# Altium schematic sheet 7_COMMUNICATION.schdoc
size 307 x 218 mm; Symbol: A4空白; Device: A4空白; @Project Name: 34567890; @Page Count: 7; @Update Date: 2025-05-12; @Create Date: 2025-03-11; @Schematic Name: Schematic1; @Page No: 7; @Page Name: COMMUNICATION; @Create Time: 07:05:34; @Board Name: PCB; @Update Time: 12:27:56; Title Block Position: 3; Width: 1170; Height: 825; Region Start: 1; X Region Count: 6; Y Region Count: 4; Blade Width: 10; SheetNumber: 7; SheetTotal: 7
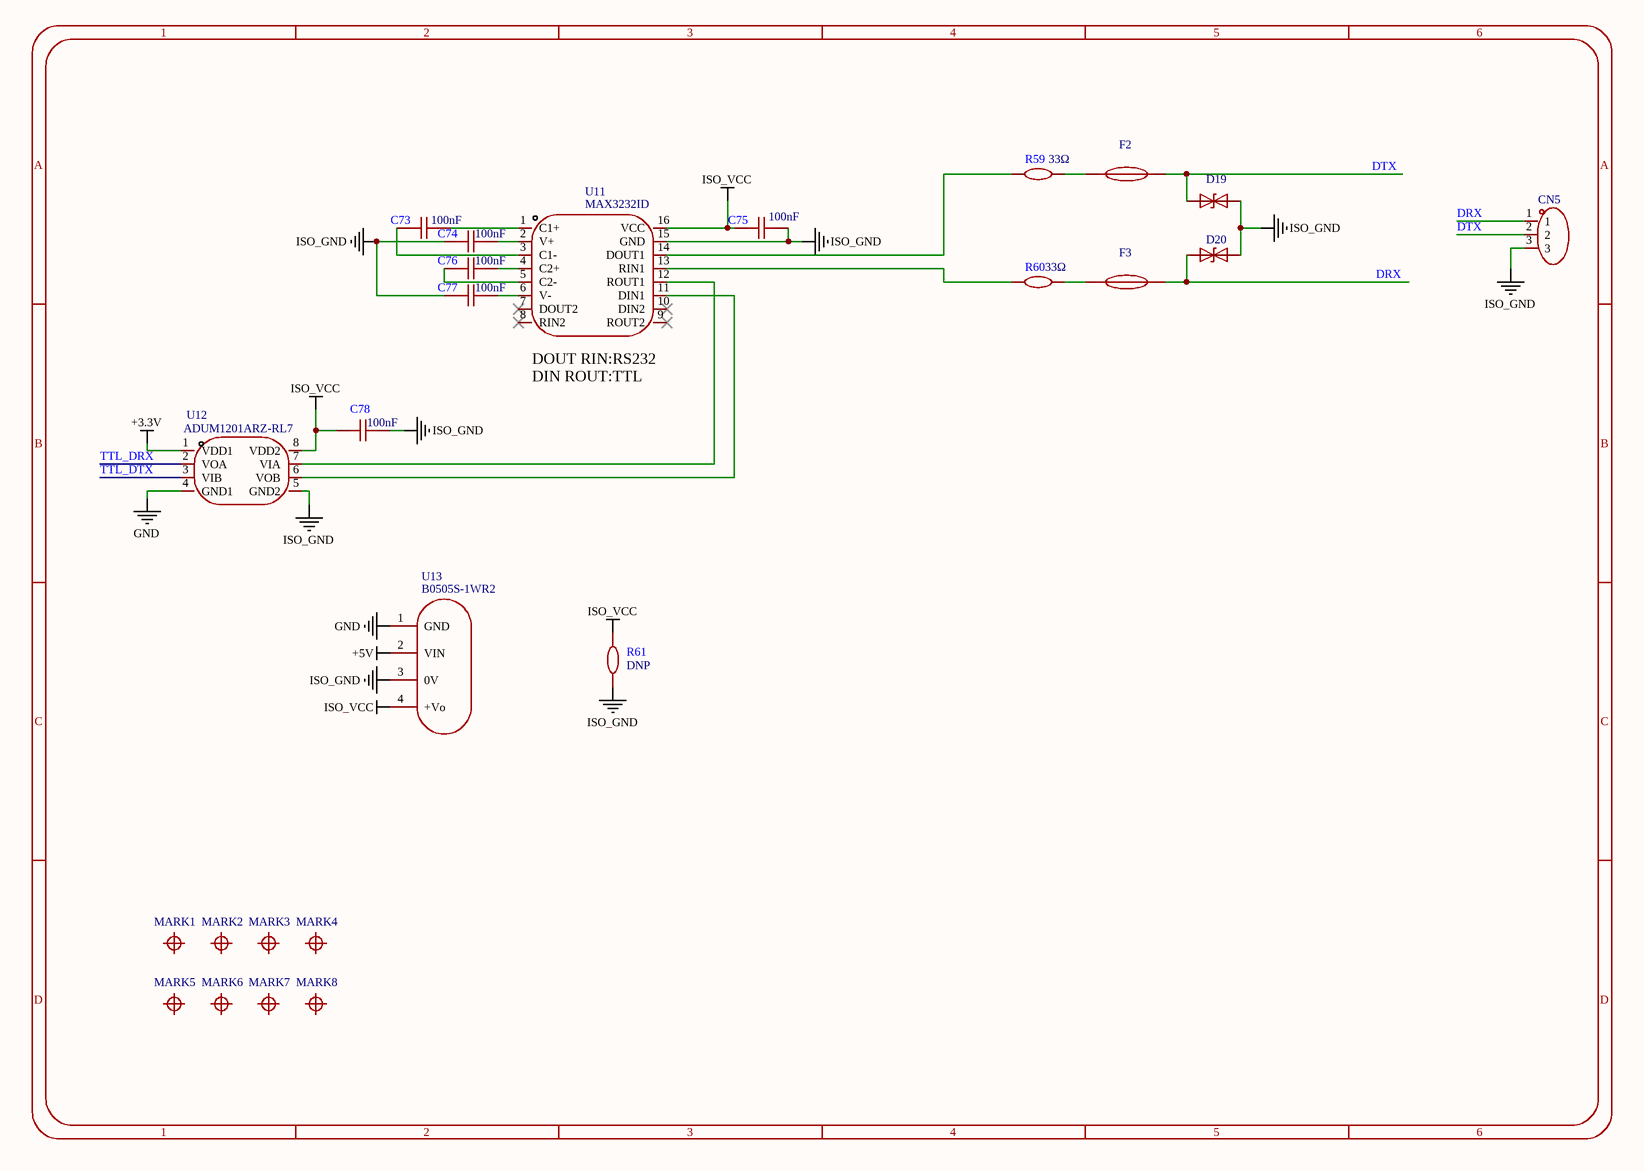
[diagram p0: 7_COMMUNICATION.schdoc]

## Parts
C73  100nF  [C0603]
C74  100nF  [C0603]
C75  100nF  [C0603]
C76  100nF  [C0603]
C77  100nF  [C0603]
C78  100nF  [C0603]
CN5  WJ15EDGRC-3.81-3P  [CONN-TH_3P-P3.81_WJ15EDGRC-3.81-3P]  (value not drawn)
D19  SMAJ15CA-E3/61  [SMA_L4.3-W2.7-LS5.1-BI]  (value not drawn)
D20  SMAJ15CA-E3/61  [SMA_L4.3-W2.7-LS5.1-BI]  (value not drawn)
F2  JK-NSMD050-30V  [F1206]  (value not drawn)
F3  JK-NSMD050-30V  [F1206]  (value not drawn)
MARK1  (no value)  [Mark-Point-1mm]
MARK2  (no value)  [Mark-Point-1mm]
MARK3  (no value)  [Mark-Point-1mm]
MARK4  (no value)  [Mark-Point-1mm]
MARK5  (no value)  [Mark-Point-1mm]
MARK6  (no value)  [Mark-Point-1mm]
MARK7  (no value)  [Mark-Point-1mm]
MARK8  (no value)  [Mark-Point-1mm]
R59  33Ω  [R0603]
R60  33Ω  [R0603]
R61  DNP  [R0603]
U11  MAX3232ID  [SOIC-16_L9.9-W3.9-P1.27-LS6.0-BL]
U12  ADUM1201ARZ-RL7  [SOIC-8_L4.9-W3.9-P1.27-LS6.0-BL]
U13  B0505S-1WR2  [PWRM-TH_BXXXXS-1WR2]

## Nets
+3.3V: U12.1(VDD1)
+5V: U13.2(VIN)
GND: U12.4(GND1) U13.1(GND)
ISO_GND: C74.2 C75.1 C77.2 C78.1 CN5.3 D19.2(A) D20.1(K) R61.1 U11.15(GND) U12.5(GND2) U13.3(0V)
ISO_VCC: C75.2 C78.2 R61.2 U11.16(VCC) U12.8(VDD2) U13.4(+Vo)
DRX: CN5.1 D20.2(A) F3.2
DTX: CN5.2 D19.1(K) F2.2
TTL_DRX: U12.2(VOA)
TTL_DTX: U12.3(VIB)
NetC73_1: C73.1 U11.1(C1+)
NetC73_2: C73.2 U11.3(C1-)
NetC74_1: C74.1 U11.2(V+)
NetC76_1: C76.1 U11.4(C2+)
NetC76_2: C76.2 U11.5(C2-)
NetC77_1: C77.1 U11.6(V-)
NetF2_1: F2.1 R59.1
NetF3_1: F3.1 R60.1
NetR59_2: R59.2 U11.14(DOUT1)
NetR60_2: R60.2 U11.13(RIN1)
NetU11_11: U11.11(DIN1) U12.6(VOB)
NetU11_12: U11.12(ROUT1) U12.7(VIA)

Not connected (* = marked no-connect by the designer): MARK1 1; MARK2 1; MARK3 1; MARK4 1; MARK5 1; MARK6 1; MARK7 1; MARK8 1; U11 7(DOUT2)* 8(RIN2)* 9(ROUT2)* 10(DIN2)*

## Notes on the sheet
- (near U11) DOUT RIN:RS232
  DIN ROUT:TTL
- 1
- 2
- 3
- 4
- 5
- 6
- A
- B
- C
- D

## Library data of the parts
C73-C78 = CAP_0603: Device: CAP_0603
MARK1-MARK8 = Mark-Point: Device: Mark-Point
R59-R61 = Res_0603: Device: Res_0603
CN5 = WJ15EDGRC-3.81-3P: Device: WJ15EDGRC-3.81-3P
D19 D20 = SMAJ15CA-E3/61: Device: SMAJ15CA-E3/61
F2 F3 = JK-NSMD050-30V: Device: JK-NSMD050-30V
U11 = MAX3232ID: Device: MAX3232ID
U12 = ADUM1201ARZ-RL7: Device: ADUM1201ARZ-RL7
U13 = B0505S-1WR2: Device: B0505S-1WR2